# Altium schematic sheet main.SchDoc
size A4
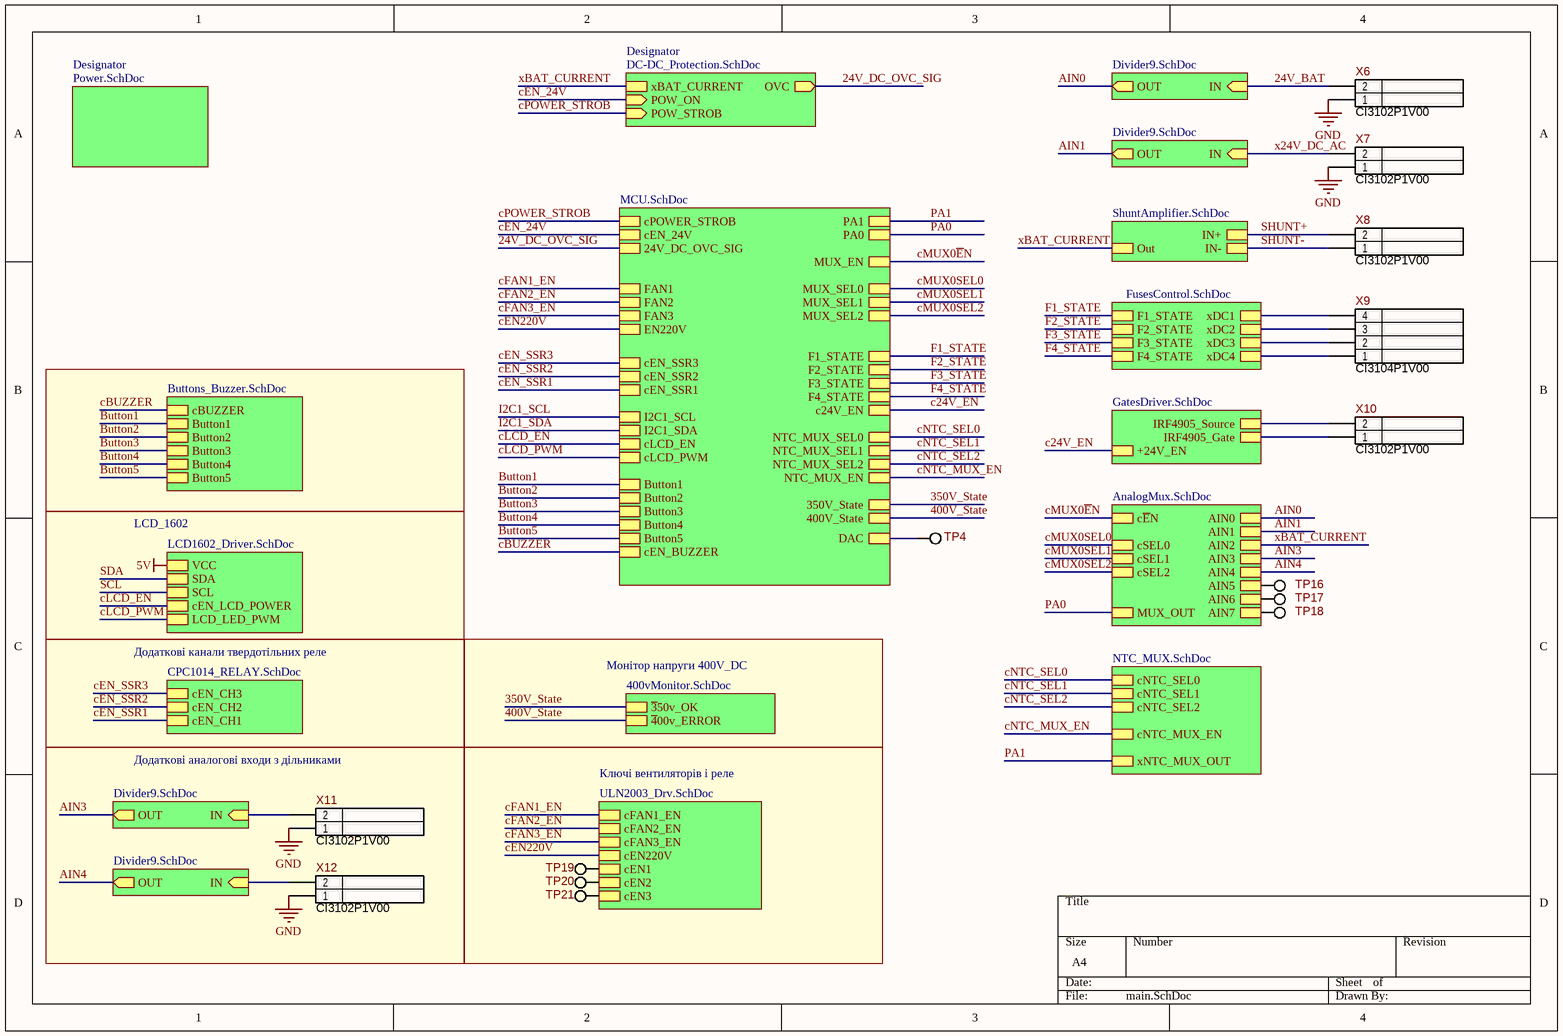
[diagram p0: main.SchDoc]

## Parts
TP4  PAD-1.1mm  [PAD-1.1mm]  (value not drawn)  (no BOM)
TP16  PAD-1.1mm  [PAD-1.1mm]  (value not drawn)  (no BOM)
TP17  PAD-1.1mm  [PAD-1.1mm]  (value not drawn)  (no BOM)
TP18  PAD-1.1mm  [PAD-1.1mm]  (value not drawn)  (no BOM)
TP19  PAD-1.1mm  [PAD-1.1mm]  (value not drawn)  (no BOM)
TP20  PAD-1.1mm  [PAD-1.1mm]  (value not drawn)  (no BOM)
TP21  PAD-1.1mm  [PAD-1.1mm]  (value not drawn)  (no BOM)
X6  WH-02S  [WF-2S]  (value not drawn)
X7  WH-02S  [WF-2S]  (value not drawn)
X8  WH-02S  [WF-2S]  (value not drawn)
X9  WH-04S  [WF-4S]  (value not drawn)
X10  WH-02S  [WF-2S]  (value not drawn)
X11  WH-02S  [WF-2S]  (value not drawn)
X12  WH-02S  [WF-2S]  (value not drawn)

## Blocks framed on the sheet
Додаткові аналогові входи з дільниками: X11 X12
Ключі вентиляторів і реле: TP19-TP21

## Sub-sheets
Designator = MCU.SchDoc: PA1, PA0, MUX_SEL0, MUX_SEL1, MUX_SEL2, MUX_EN, F3_STATE, F4_STATE, F2_STATE, F1_STATE, c24V_EN, NTC_MUX_SEL2, NTC_MUX_SEL0, NTC_MUX_SEL1, NTC_MUX_EN, 350V_State, 400V_State, cPOWER_STROB, cEN_24V, 24V_DC_OVC_SIG, FAN1, FAN3, EN220V, FAN2, cEN_SSR3, cEN_SSR1, cEN_SSR2, cLCD_EN, I2C1_SCL, cLCD_PWM, I2C1_SDA, Button3, Button5, Button1, Button2, cEN_BUZZER, Button4, DAC
Designator = AnalogMux.SchDoc: cSEL1, AIN7, AIN1, AIN0, MUX_OUT, AIN6, cSEL0, AIN4, AIN5, AIN3, AIN2, cSEL2, c~{E}N
Designator = Power.SchDoc: no entries
Designator = Divider9.SchDoc: OUT (out), IN (in)
Designator = Divider9.SchDoc: OUT (out), IN (in)
Designator = ShuntAmplifier.SchDoc: IN-, Out, IN+
Designator = FusesControl.SchDoc: xDC1, xDC3, xDC4, xDC2, F2_STATE, F3_STATE, F4_STATE, F1_STATE
Designator = GatesDriver.SchDoc: IRF4905_Source, +24V_EN, IRF4905_Gate
Designator = NTC_MUX.SchDoc: cNTC_SEL2, cNTC_SEL1, cNTC_SEL0, cNTC_MUX_EN, xNTC_MUX_OUT
Designator = 400vMonitor.SchDoc: ~{3}50v_OK, ~{4}00v_ERROR
Designator = DC-DC_Protection.SchDoc: OVC (out), POW_ON (in), xBAT_CURRENT, POW_STROB (in)
Designator = ULN2003_Drv.SchDoc: cFAN2_EN, cEN1, cEN220V, cEN3, cFAN1_EN, cFAN3_EN, cEN2
Designator = Divider9.SchDoc: OUT (out), IN (in)
Designator = Divider9.SchDoc: OUT (out), IN (in)
Designator = CPC1014_RELAY.SchDoc: cEN_CH3, cEN_CH2, cEN_CH1
Designator = LCD1602_Driver.SchDoc: SDA, SCL, cEN_LCD_POWER, LCD_LED_PWM, VCC
Designator = Buttons_Buzzer.SchDoc: cBUZZER, Button3, Button4, Button1, Button2, Button5

## Nets
5V: sheet Designator/VCC
GND: X6.1 X7.1 X11.1 X12.1
24V_BAT: X6.2 ; sheet Designator/IN
24V_DC_OVC_SIG: sheet Designator/24V_DC_OVC_SIG, sheet Designator/OVC
350V_State: sheet Designator/350V_State, sheet Designator/~{3}50v_OK
400V_State: sheet Designator/400V_State, sheet Designator/~{4}00v_ERROR
AIN0: sheet Designator/AIN0, sheet Designator/OUT
AIN1: sheet Designator/AIN1, sheet Designator/OUT
AIN3: sheet Designator/AIN3, sheet Designator/OUT
AIN4: sheet Designator/AIN4, sheet Designator/OUT
Button1: sheet Designator/Button1, sheet Designator/Button1
Button2: sheet Designator/Button2, sheet Designator/Button2
Button3: sheet Designator/Button3, sheet Designator/Button3
Button4: sheet Designator/Button4, sheet Designator/Button4
Button5: sheet Designator/Button5, sheet Designator/Button5
c24V_EN: sheet Designator/c24V_EN, sheet Designator/+24V_EN
cBUZZER: sheet Designator/cEN_BUZZER, sheet Designator/cBUZZER
cEN220V: sheet Designator/EN220V, sheet Designator/cEN220V
cEN_24V: sheet Designator/cEN_24V, sheet Designator/POW_ON
cEN_SSR1: sheet Designator/cEN_SSR1, sheet Designator/cEN_CH1
cEN_SSR2: sheet Designator/cEN_SSR2, sheet Designator/cEN_CH2
cEN_SSR3: sheet Designator/cEN_SSR3, sheet Designator/cEN_CH3
cFAN1_EN: sheet Designator/FAN1, sheet Designator/cFAN1_EN
cFAN2_EN: sheet Designator/FAN2, sheet Designator/cFAN2_EN
cFAN3_EN: sheet Designator/FAN3, sheet Designator/cFAN3_EN
cLCD_EN: sheet Designator/cLCD_EN, sheet Designator/cEN_LCD_POWER
cLCD_PWM: sheet Designator/cLCD_PWM, sheet Designator/LCD_LED_PWM
cMUX0~{E}N: sheet Designator/MUX_EN, sheet Designator/c~{E}N
cMUX0SEL0: sheet Designator/MUX_SEL0, sheet Designator/cSEL0
cMUX0SEL1: sheet Designator/MUX_SEL1, sheet Designator/cSEL1
cMUX0SEL2: sheet Designator/MUX_SEL2, sheet Designator/cSEL2
cNTC_MUX_EN: sheet Designator/NTC_MUX_EN, sheet Designator/cNTC_MUX_EN
cNTC_SEL0: sheet Designator/NTC_MUX_SEL0, sheet Designator/cNTC_SEL0
cNTC_SEL1: sheet Designator/NTC_MUX_SEL1, sheet Designator/cNTC_SEL1
cNTC_SEL2: sheet Designator/NTC_MUX_SEL2, sheet Designator/cNTC_SEL2
cPOWER_STROB: sheet Designator/cPOWER_STROB, sheet Designator/POW_STROB
F1_STATE: sheet Designator/F1_STATE, sheet Designator/F1_STATE
F2_STATE: sheet Designator/F2_STATE, sheet Designator/F2_STATE
F3_STATE: sheet Designator/F3_STATE, sheet Designator/F3_STATE
F4_STATE: sheet Designator/F4_STATE, sheet Designator/F4_STATE
I2C1_SCL: sheet Designator/I2C1_SCL
I2C1_SDA: sheet Designator/I2C1_SDA
PA0: sheet Designator/PA0, sheet Designator/MUX_OUT
PA1: sheet Designator/PA1, sheet Designator/xNTC_MUX_OUT
SCL: sheet Designator/SCL
SDA: sheet Designator/SDA
SHUNT+: X8.2 ; sheet Designator/IN+
SHUNT-: X8.1 ; sheet Designator/IN-
x24V_DC_AC: X7.2 ; sheet Designator/IN
xBAT_CURRENT: sheet Designator/AIN2, sheet Designator/Out, sheet Designator/xBAT_CURRENT
NetTP4_1: TP4.1 ; sheet Designator/DAC
NetTP16_1: TP16.1 ; sheet Designator/AIN5
NetTP17_1: TP17.1 ; sheet Designator/AIN6
NetTP18_1: TP18.1 ; sheet Designator/AIN7
NetTP19_1: TP19.1 ; sheet Designator/cEN1
NetTP20_1: TP20.1 ; sheet Designator/cEN2
NetTP21_1: TP21.1 ; sheet Designator/cEN3
NetX9_1: X9.1 ; sheet Designator/xDC4
NetX9_2: X9.2 ; sheet Designator/xDC3
NetX9_3: X9.3 ; sheet Designator/xDC2
NetX9_4: X9.4 ; sheet Designator/xDC1
NetX10_1: X10.1 ; sheet Designator/IRF4905_Gate
NetX10_2: X10.2 ; sheet Designator/IRF4905_Source
NetX11_2: X11.2 ; sheet Designator/IN
NetX12_2: X12.2 ; sheet Designator/IN

## Notes on the sheet
- LCD_1602
- Додаткові канали твердотільних реле
- Монітор напруги 400V_DC

## Library data of the parts
TP4 TP16-TP21 = PAD-1.1mm: 1.1mm Pad for Plug-In or Receptacle; Ajax_1C_PN: NONE; Ajax_1С_Status: RND Only; Component Status: Released; Lifecycle: ="Lifecycle"; Part Number: PAD-1.1mm; Component Type: PTH; Manufacturer: NONE; Part Type: Pad; Temperature Range: NONE; ComponentLink1URL: NONE; Replacement: NONE; Price: NONE; ComponentLink1Description: Datasheet
X6-X8 X10-X12 = CI3102P1V00: WH Series 2.54mm Wire to Board Straight DIP Type Headers, 2-Pin; Manufacturer: CviLux; Ajax_1C_PN: NONE; Part Number: CI3102P1V00; Part Type: Wire-to-Board; Component Type: PTH; Lifecycle: RND Only; Temperature Range: -25℃ ~ 85℃; ComponentLink1URL: https://www.cvilux.com/uploads/drawings/100/723/CI3102S.pdf; Replacement: NONE; ComponentLink1Description: Datasheet
X9 = CI3104P1V00: WH Series 2.54mm Wire to Board Straight DIP Type Headers, 4 Pin; Manufacturer: CviLux; Ajax_1C_ID: 1232; Ajax_1C_PN: WF-04S, разъем 4 пина "папа", на плату; Ajax_1С_Status: RND Only; Component Status: Released; Replacement: NONE; GUID_1C: 2c368b74-dd41-11e0-af93-6c626deda1bb; System: Connector; Part Number: CI3104P1V00; Part Type: Wire-to-Board / Header; Component Type: PTH; Temperature Range: -25℃ ~ 85℃; ComponentLink1URL: https://www.cvilux.com/uploads/drawings/100/723/CI3102S.pdf; Price: 0,06818182; ComponentLink1Description: Datasheet